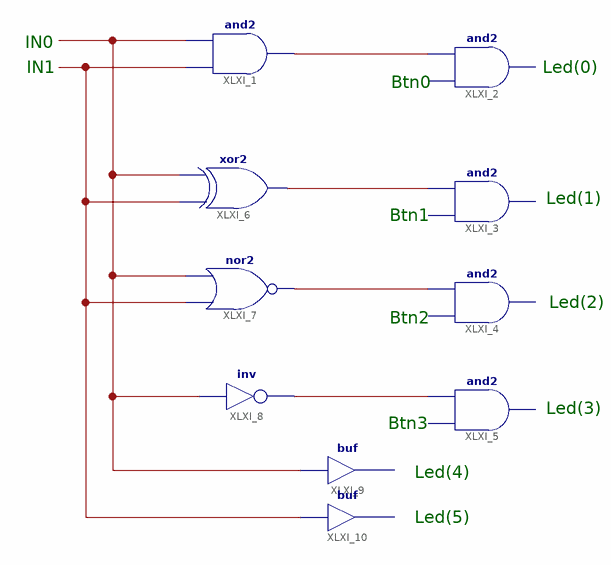
[diagram p0: schematic sheet 1]
// Xilinx ISE schematic circuit1.sch (spartan3e) as structural Verilog: 10 symbols, 0 ports
module circuit1 (
);

  wire XLXN_3, XLXN_4, XLXN_5, XLXN_6, XLXN_8, XLXN_23;

  and XLXI_1 (XLXN_5, XLXN_23, XLXN_8);
  // and2 XLXI_2 has open pins: I0=open, I1=XLXN_5, O=open
  // and2 XLXI_3 has open pins: I0=open, I1=XLXN_6, O=open
  // and2 XLXI_4 has open pins: I0=open, I1=XLXN_4, O=open
  // and2 XLXI_5 has open pins: I0=open, I1=XLXN_3, O=open
  xor XLXI_6 (XLXN_6, XLXN_23, XLXN_8);
  nor XLXI_7 (XLXN_4, XLXN_23, XLXN_8);
  not XLXI_8 (XLXN_3, XLXN_8);
  // buf XLXI_9 has open pins: I=XLXN_8, O=open
  // buf XLXI_10 has open pins: I=XLXN_23, O=open

  // Notes on the sheet:
  //   IN0
  //   IN1
  //   Led(0)
  //   Btn0
  //   Led(1)
  //   Btn1
  //   Led(2)
  //   Btn2
  //   Led(3)
  //   Btn3
  //   Led(4)
  //   Led(5)
endmodule
